# EasyEDA Pro project foc电动螺丝刀.eprj, board PCB1_1
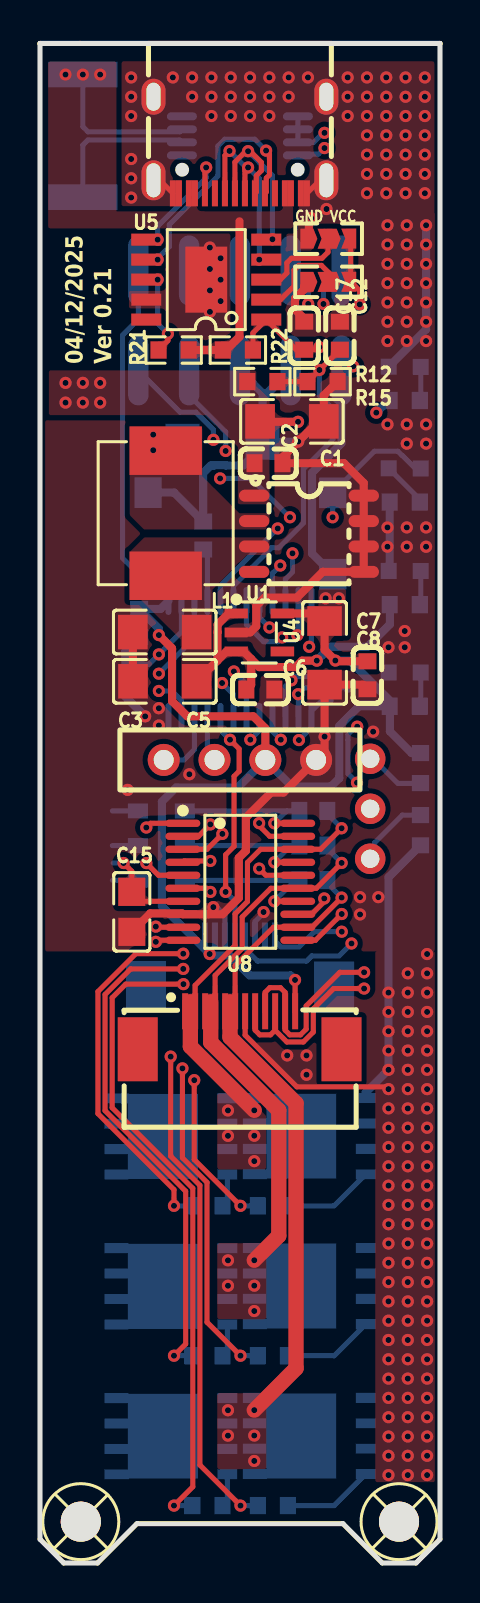
[diagram p3: board, top side]
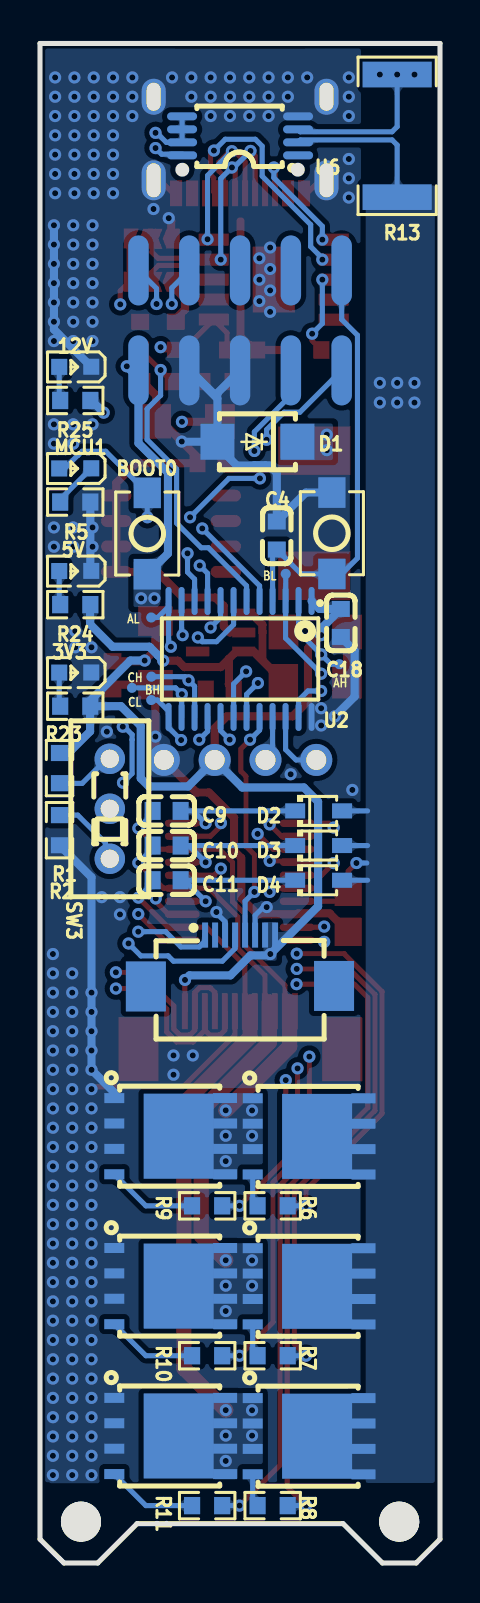
[diagram p4: board, bottom side, seen from below]

Outline 20 x 76 mm; copper layers: Top Layer, Inner1, Inner2, Bottom Layer. Coordinates in mm from the lower left corner of the outline.
Outline path: 0,76 20,76 20,1.19 18.8,0 17.11,0 15.15,1.97 4.84,1.97 2.88,0 1.19,0 0,1.19 0,76
Stack: Top Layer 0.035mm 外层铜厚1oz / Dielectric1 0.2104mm 7628 RC49% 8.6mil / Inner1 0.0152mm 内层铜厚 / Dielectric2 1.065mm 1.1mm H/HOZ Copper / Inner2 0.0152mm 内层铜厚 / Dielectric3 0.2104mm 7628 RC49% 8.6mil / Bottom Layer 0.035mm 外层铜厚1oz

## Design rules (mm)
template: 自定义配置1
spacing copperThickness1oz (default): track to track 0.102, other pairs 0.152 to 0.3
spacing copperThickness2oz: track to track 0.203, other pairs 0.152 to 0.3
track width copperThickness1oz (default): min 0.127, default 0.254, max 2.54
track width copperThickness2oz: min 0.203, default 0.406, max 2.54
track width trackWidth1: min 0.254, default 0.762, max 2.54
differential pair differentialPair (default): width min 0.127, default 0.254, max 2.54; gap min 0.152, default 0.152
via viaSize (default): diameter min 0.5, default 0.61, max 10; hole min 0.3, default 0.305, max 6.299
net L_VS2 uses copperRegionAll, trackWidth1
net L_VS3 uses copperRegionAll, trackWidth1
net +5V uses copperRegionAll, copperThickness2oz
net GND uses copperRegionAll, copperThickness2oz
net +12V uses copperRegionAll, copperThickness2oz
net L_VS1 uses copperRegionAll, trackWidth1
net +3V3 uses copperRegionAll
net +12V_BEFORE uses copperRegionAll, copperThickness2oz
net $1N4187 uses copperRegionAll

## Placement (name value [footprint] x y rotation side)
3V3  -  [LED_0603]  18.29 44.53 0 bottom
5V  -  [LED_0603]  18.29 49.61 0 bottom
12V  -  [LED_0603]  18.29 59.82 0 bottom
BOOT0  轻触按键3*4*H  [SW-SMD_L4.0-W2.9-LS5.0]  14.64 51.49 270 bottom
C1  10uF  [C1206]  12.6 57.1 0 top
C2  1uF  [C0603]  11.42 55.01 0 top
C3  22uF  [C1206]  6.24 46.56 0 top
C4  100nf  [C0603]  8.16 51.39 90 bottom
C5  10uf  [C1206]  6.24 44.1 180 top
C6  100nf  [C0603]  11.02 43.69 180 top
C7  10uf  [C1206]  14.23 45.52 270 top
C8  100nf  [C0603]  16.37 44.4 90 top
C9  100nF  [C0603]  13.67 37.62 0 bottom
C10  100nF  [C0603]  13.67 35.88 0 bottom
C11  100nF  [C0603]  13.67 34.15 0 bottom
C12  100nF  [C0603]  14.99 61.38 270 top
C15  22uF  [C0805]  4.59 32.57 90 top
C17  1uF  [C0603]  13.21 61.38 270 top
C18  100nF  [C0603]  4.96 47.02 270 bottom
D1  SS34F  [SMAF_L3.5-W2.6-LS4.7-FD]  9.13 56.08 180 bottom
D2  1N5819WS  [SOD-323_L1.8-W1.3-LS2.5-RD]  6.07 37.62 180 bottom
D3  1N5819WS  [SOD-323_L1.8-W1.3-LS2.5-RD]  6.07 35.88 180 bottom
D4  1N5819WS  [SOD-323_L1.8-W1.3-LS2.5-RD]  6.07 34.15 180 bottom
FPC1  FPC-05F-8PH20  [FPC-SMD_8P-P0.50_FPC-05F-8PH20]  10 30.12 180 bottom
FPC2  KH-CL0.5-H2.0-12PIN-SMT  [FPC-SMD_12P-P0.50_KH-CL0.5-H2.0-12PIN-SMT]  10.01 26.65 0 top
L1  47uH  [IND-SMD_L7.0-W6.6_FXL0630]  6.28 52.51 270 top
MCU1  -  [LED_0603]  18.29 54.74 0 bottom
OLED1  HS91L02W2C01  [OLED-TH_L38.0-W12.0_HS91L02W2C01]  10 40.17 90 top
P1  -  [PAD_S_2.54_2*5]  10 62.15 180 bottom
Q1  TPH1R403NL  [DSOP-8_L5.0-W5.0-P1.27-LS6.0-BL-EP]  6.6 21.34 270 bottom
Q2  TPH1R403NL  [DSOP-8_L5.0-W5.0-P1.27-LS6.0-BL-EP]  6.6 13.84 270 bottom
Q3  TPH1R403NL  [DSOP-8_L5.0-W5.0-P1.27-LS6.0-BL-EP]  6.6 6.34 270 bottom
Q4  TPH1R403NL  [DSOP-8_L5.0-W5.0-P1.27-LS6.0-BL-EP]  13.51 21.35 270 bottom
Q5  TPH1R403NL  [DSOP-8_L5.0-W5.0-P1.27-LS6.0-BL-EP]  13.51 13.85 270 bottom
Q6  TPH1R403NL  [DSOP-8_L5.0-W5.0-P1.27-LS6.0-BL-EP]  13.51 6.35 270 bottom
R1  10K  [R0603]  19.02 39.76 270 bottom
R2  10K  [R0603]  19.02 36.65 90 bottom
R5  10K  [R0603]  18.24 53.06 0 bottom
R6  10Ω  [R0603]  8.37 17.87 180 bottom
R7  10Ω  [R0603]  8.37 10.37 180 bottom
R8  10Ω  [R0603]  8.37 2.87 180 bottom
R9  10Ω  [R0603]  11.64 17.86 180 bottom
R10  10Ω  [R0603]  11.64 10.37 180 bottom
R11  10Ω  [R0603]  11.64 2.87 180 bottom
R12  10K  [R0603]  11.12 59.09 0 top
R13  10MΩ  [R2512]  2.14 71.38 270 bottom
R15  1K  [R0603]  14.13 59.09 180 top
R21  10K  [R0603]  6.68 60.67 180 top
R22  1K  [R0603]  9.89 60.67 180 top
R23  10K  [R0603]  18.24 42.85 0 bottom
R24  22K  [R0603]  18.24 47.93 0 bottom
R25  47K  [R0603]  18.24 58.14 0 bottom
SCREW1  -  [M2螺丝]  2.04 2.07 0 top
SCREW2  -  [M2螺丝]  17.95 2.07 0 top
SW2  nRST  [SW-SMD_L4.0-W2.9-LS5.0]  5.41 51.5 270 bottom
SW3  SS12D00G3  [SW-TH_SS-12D01-GX]  16.51 37.72 90 bottom
TP1  -  [Test-Point-0.5mm]  14.44 43.16 180 bottom
TP2  -  [Test-Point-0.5mm]  15.4 43.77 180 bottom
TP3  -  [Test-Point-0.5mm]  14.43 44.33 180 bottom
TP4  -  [Test-Point-0.5mm]  14.44 47.29 180 bottom
TP5  -  [Test-Point-0.5mm]  7.71 49.47 180 bottom
TP6  -  [Test-Point-0.5mm]  5.03 44.95 180 bottom
U1  XL1509-5.0  [SOIC-8_L4.9-W3.9-P1.27-LS6.0-TR]  13.45 51.48 90 top
U2  -  [TSSOP-24_L7.8-W4.4-P0.65-LS6.4-BL]  10 45.22 0 bottom
U4  TPRT9013-33GB  [SOT-23-5_L3.0-W1.7-P0.95-LS2.8-BL]  10.97 46.54 270 top
U5  CH224K  [ESSOP-10_L4.9-W3.9-P1.0-LS6.0-TL-EP]  8.31 64.19 90 top
U6  INA240A1PW  [TSSOP-8_L4.4-W3.0-P0.65-LS6.4-TL]  10 71.38 0 bottom
U8  FD6288T  [TSSOP-20_L6.5-W4.4-P0.65-LS6.4-BL]  10.01 34.07 270 top
U9  CFG3  [双置短接焊盘]  14.43 66.24 180 top
U10  CFG2  [双置短接焊盘]  14.43 64.08 180 top
USB1  typec  [USB-C-SMD_KH-TYPE-C-16P]  10 70.92 180 top

## Footprints (pads in the part's own frame, mm; a bottom-side part is the same pattern mirrored in y, then rotated)
C0603
  rect 0.8x0.9 smd: 1(-0.7,0) 2(0.7,0)
C0805
  rect 1.41x1.35 smd: 1(-1,0) 2(1,0)
C1206
  rect 1.485x1.728 smd: 1(-1.593,0) 2(1.593,0)
DSOP-8_L5.0-W5.0-P1.27-LS6.0-BL-EP
  rect 0.5x1 smd: 1(-1.905,-2.77) 2(-0.635,-2.77) 3(0.634,-2.77) 4(1.905,-2.77)
  rect 0.5x1.2 smd: 5(1.905,2.77) 6(0.635,2.77) 7(-0.634,2.77) 8(-1.905,2.77)
  custom 4.25x3.5 smd: 9(0,0.45)
ESSOP-10_L4.9-W3.9-P1.0-LS6.0-TL-EP
  rect 0.6x1.5 smd: 1(-2,-3) 2(-1,-3) 3(0,-3) 4(1,-3) 5(2,-3) 6(2,3) 7(1,3) 8(0,3) 9(-1,3) 10(-2,3)
  rect 3.3x2.1 smd: 11(0,0)
FPC-SMD_8P-P0.50_FPC-05F-8PH20
  rect 0.3x1.25 smd: 1(-1.75,1.288) 2(-1.25,1.288) 3(-0.75,1.288) 4(-0.25,1.288) 5(0.25,1.288) 6(0.75,1.288) 7(1.25,1.288) 8(1.75,1.288)
  rect 2x2.5 smd: 9(4.699,-1.258) 10(-4.712,-1.282)
FPC-SMD_12P-P0.50_KH-CL0.5-H2.0-12PIN-SMT
  rect 0.3x1.8 smd: 1(-2.75,0.95) 2(-2.25,0.95) 3(-1.75,0.95) 4(-1.25,0.95) 5(-0.75,0.95) 6(-0.25,0.95) 7(0.25,0.95) 8(0.75,0.95) 9(1.25,0.95) 10(1.75,0.95) 11(2.25,0.95) 12(2.75,0.95)
  rect 2x3.2 smd: 13(5.07,-0.95) 14(-5.119,-0.95)
IND-SMD_L7.0-W6.6_FXL0630
  rect 2.424x3.62 smd: 1(3.128,0) 2(-3.128,0)
LED_0603
  rect 0.8x0.8 smd: 1(-0.851,-0.01) 2(0.75,-0.005)
M2螺丝
  round 2 hole 2: 1(0,0)
OLED-TH_L38.0-W12.0_HS91L02W2C01
  round 1.6 hole 1: 1(0,-3.81) 2(0,-1.27) 3(0,1.27) 4(0,3.81)
PAD_S_2.54_2*5
  oval 1.02x3.5 smd: 1(-5.08,2.5) 2(-2.54,2.5) 3(0,2.5) 4(2.54,2.5) 5(5.08,2.5) 6(-5.08,-2.5) 7(-2.54,-2.5) 8(0,-2.5) 9(2.54,-2.5) 10(5.08,-2.5)
R0603
  rect 0.806x0.864 smd: 1(-0.753,0) 2(0.753,0)
R2512
  rect 1.282x3.456 smd: 1(-3.067,0) 2(3.067,0)
SMAF_L3.5-W2.6-LS4.7-FD
  rect 1.7x1.8 smd: 1(-2,0) 2(2,0)
SOD-323_L1.8-W1.3-LS2.5-RD
  rect 1x0.75 smd: 1(-1.173,0) 2(1.173,0)
SOIC-8_L4.9-W3.9-P1.27-LS6.0-TR
  oval 0.6x1.52 smd: 1(1.905,2.74) 2(0.635,2.74) 3(-0.635,2.74) 4(-1.905,2.74) 5(-1.905,-2.74) 6(-0.635,-2.74) 7(0.635,-2.74) 8(1.905,-2.74)
SOT-23-5_L3.0-W1.7-P0.95-LS2.8-BL
  rect 0.49x1.157 smd: 1(-0.95,-1.153) 2(0,-1.153) 3(0.95,-1.153)
  rect 0.49x1.175 smd: 4(0.95,1.153) 5(-0.95,1.153)
SW-SMD_L4.0-W2.9-LS5.0
  rect 1.53x1.36 smd: 1(-2.035,0) 2(2.035,0)
SW-TH_SS-12D01-GX
  round 1.524 hole 0.914: 1(-2.5,0) 2(0,0) 3(2.5,0)
Test-Point-0.5mm
  round 0.5 smd: 1(0,0)
TSSOP-8_L4.4-W3.0-P0.65-LS6.4-TL
  oval 1.5x0.4 smd: 1(-2.9,0.976) 2(-2.9,0.325) 3(-2.9,-0.325) 4(-2.9,-0.976) 5(2.9,-0.976) 6(2.9,-0.325) 7(2.9,0.325) 8(2.9,0.976)
TSSOP-20_L6.5-W4.4-P0.65-LS6.4-BL
  oval 0.364x1.742 smd: 1(-2.925,-2.871) 2(-2.275,-2.871) 3(-1.625,-2.871) 4(-0.975,-2.871) 5(-0.325,-2.871) 6(0.325,-2.871) 7(0.975,-2.871) 8(1.625,-2.871) 9(2.275,-2.871) 10(2.925,-2.871) 11(2.925,2.871) 12(2.275,2.871) 13(1.625,2.871) 14(0.975,2.871) 15(0.325,2.871) 16(-0.325,2.871) 17(-0.975,2.871) 18(-1.625,2.871) 19(-2.275,2.871) 20(-2.925,2.871)
TSSOP-24_L7.8-W4.4-P0.65-LS6.4-BL
  oval 0.3x1.4 smd: 1(-3.575,-2.9) 2(-2.925,-2.9) 3(-2.275,-2.9) 4(-1.625,-2.9) 5(-0.975,-2.9) 6(-0.325,-2.9) 7(0.325,-2.9) 8(0.975,-2.9) 9(1.625,-2.9) 10(2.275,-2.9) 11(2.925,-2.9) 12(3.575,-2.9) 13(3.575,2.9) 14(2.925,2.9) 15(2.275,2.9) 16(1.625,2.9) 17(0.975,2.9) 18(0.325,2.9) 19(-0.325,2.9) 20(-0.975,2.9) 21(-1.625,2.9) 22(-2.275,2.9) 23(-2.925,2.9) 24(-3.575,2.9)
USB-C-SMD_KH-TYPE-C-16P
  oval 1.2x2 hole 0.7x1.7: 1(-4.32,1.765) 2(4.32,1.765)
  oval 1.2x1.8 hole 0.7x1.4: 3(-4.32,-2.415) 4(4.32,-2.415)
  rect 0.3x1.3 smd: A1(-3.35,2.415) A4(-2.55,2.415) A5(-1.25,2.415) A6(-0.25,2.415) A7(0.25,2.415) A8(1.25,2.415) A9(2.55,2.415) A12(3.35,2.415) B1(3.05,2.415) B4(2.25,2.415) B5(1.75,2.415) B6(0.75,2.415) B7(-0.75,2.415) B8(-1.75,2.415) B9(-2.25,2.415) B12(-3.05,2.415)
双置短接焊盘
  custom 0.748x1.005 smd: 1(-1.105,-0.004)
  custom 1.154x1.006 smd: 2(-0.025,0)
  custom 0.853x1.001 smd: 3(0.991,0)

## Nets
+3V3: BOOT0.2 C7.1 C8.2 C18.1 FPC1.7 FPC1.8 FPC2.12 OLED1.2 P1.6 R1.1 R23.1 U2.1 U4.5 U6.5 U6.6 U6.7
+5V: C3.2 C5.1 C6.2 L1.1 R24.1 U1.3 U4.1 U4.3
+12V: C1.1 C2.1 C15.2 D2.2 D3.2 D4.2 Q1.5 Q1.6 Q1.7 Q1.8 Q1.9 Q2.5 Q2.6 Q2.7 Q2.8 Q2.9 Q3.5 Q3.6 Q3.7 Q3.8 Q3.9 R12.1 R13.2 R25.1 U1.1 U6.2 U8.7
+12V_BEFORE: R13.1 R21.1 R22.2 U6.3 USB1.A4 USB1.A9 USB1.B4 USB1.B9
GND: 3V3.1 5V.1 12V.1 C1.2 C2.2 C3.1 C4.2 C5.2 C6.1 C7.2 C8.1 C12.1 C15.1 C17.1 C18.2 D1.1 FPC1.3 FPC1.6 FPC2.7 OLED1.1 P1.7 P1.8 Q4.1 Q4.2 Q4.3 Q5.1 Q5.2 Q5.3 Q6.1 Q6.2 Q6.3 R2.1 R5.1 R15.1 SW2.1 U1.5 U1.6 U1.7 U1.8 U2.24 U4.2 U5.9 U5.11 U6.4 U8.8 U9.3 U10.3 USB1.1 USB1.2 USB1.3 USB1.4 USB1.A1 USB1.A12 USB1.B1 USB1.B12
VDD: C17.2 R22.1 U5.1 U9.1 U10.1
CC1: U5.7 USB1.A5
CC2: U5.6 USB1.B5
CFG2: U5.2 U10.2
CFG3: U5.3 U9.2
DM: U5.5 USB1.A7 USB1.B7
DP: U5.4 USB1.A6 USB1.B6
E_A: FPC1.1 U2.7
E_B: FPC1.4 U2.8
E_PUSH: FPC1.5 U2.20
H_ADC_A: FPC2.9 FPC2.11 U2.9
H_ADC_B: FPC2.8 FPC2.10 U2.10
I2C_SCL: OLED1.3 U2.21
I2C_SDA: OLED1.4 U2.22
L_AH: R6.2 U8.19
L_AL: R9.2 U8.11
L_BH: R7.2 U8.16
L_BL: R10.2 U8.10
L_CH: R8.2 U8.13
L_CL: R11.2 U8.9
L_VB1: C9.1 D2.1 U8.20
L_VB2: C10.1 D3.1 U8.17
L_VB3: C11.1 D4.1 U8.14
L_VS1: C9.2 FPC2.1 FPC2.2 Q1.1 Q1.2 Q1.3 Q4.5 Q4.6 Q4.7 Q4.8 Q4.9 U8.18
L_VS2: C10.2 FPC2.3 FPC2.4 Q2.1 Q2.2 Q2.3 Q5.5 Q5.6 Q5.7 Q5.8 Q5.9 U8.15
L_VS3: C11.2 FPC2.5 FPC2.6 Q3.1 Q3.2 Q3.3 Q6.5 Q6.6 Q6.7 Q6.8 Q6.9 U8.12
LED/BOOT0: BOOT0.1 MCU1.2 U2.23
M_ADC: U2.5 U6.8
M_AH: TP6.1 U2.2 U8.1
M_AL: TP4.1 U2.12 U8.4
M_BH: TP2.1 U2.14 U8.2
M_BL: TP5.1 U2.3 U8.5
M_BRK: SW3.2 U2.11
M_CH: TP3.1 U2.15 U8.3
M_CL: TP1.1 U2.13 U8.6
NRST: C4.1 P1.5 SW2.2 U2.4
PWR: C12.2 R12.2 R15.2 U2.6
RX: P1.10 U2.19
SW_CLK: P1.2 U2.17
SW_DIO: P1.1 U2.16
TX: P1.9 U2.18
$1N3741: Q4.4 R9.1
$1N3748: Q5.4 R10.1
$1N3762: Q1.4 R6.1
$1N3769: Q2.4 R7.1
$1N3776: Q3.4 R8.1
$1N3872: Q6.4 R11.1
$1N4187: D1.2 L1.2 U1.2
$1N5948: R21.2 U5.8
$1N6225: R1.2 SW3.3
$1N6251: R2.2 SW3.1
$1N10226: 3V3.2 R23.2
$1N10294: 5V.2 R24.2
$1N10362: 12V.2 R25.2
$1N25782: MCU1.1 R5.2

Pads without a net: FPC1 2 9 10; FPC2 13 14; P1 3 4; SCREW1 1; SCREW2 1; U1 4; U4 4; U5 10; U6 1; USB1 A8 B8

## Via types
v1: diameter 0.61, hole 0.305, Top Layer to Bottom Layer, 311 vias

## Routing (per net, layer and track width the routed paths; a pad name or vN(x,y) marks a point on that pad's centre or on a via; arc(x,y) is an arc through that point)
+3V3: length 86.1
  Top Layer w0.254: v1(12.75,29.16) 12.76,29.16 12.76,27.6
  Top Layer w0.406: C8.2 14.8,45.1 v1(14.77,45.14) 14.23,45.67 C7.1 13.85,47.49 12.12,47.49 ; OLED1.2 11.27,41.75 10.67,42.35 7.37,42.35 6.6,43.11 6.6,45.72 6.58,45.74 6.58,45.77 v1(5.94,46.41)
  Inner2 w0.406: v1(15.66,59.85) 16.71,60.91 16.71,67.08 15.49,68.3 15.49,70.9 14.86,71.53 v1(14.22,71.53)
  Bottom Layer w0.254: v1(14.22,71.53) 14.16,71.53 13.68,71.05 U6.7 U6.6 U6.5
  Bottom Layer w0.406: 17.5,42.85 17.5,41.59 18.57,40.51 R1.1 ; 17.5,42.85 17.5,43.12 15.48,45.14 v1(14.77,45.14) ; 17.5,42.85 15.95,42.85 14.96,41.86 14.96,39.25 14.56,38.84 12.59,38.84 OLED1.2 9.89,38.79 6.81,38.79 6.1,38.08 6.1,32.85 v1(8.48,30.46) 8.55,30.39 9.48,30.39 10.48,29.39 12.52,29.39 v1(12.75,29.16) ; 6.42,48.12 6.02,47.72 C18.1 5.94,46.73 v1(5.94,46.41) ; BOOT0.2 13.6,50.49 13.6,54.53 15.08,56.01 P1.6 15.46,59.65 v1(15.66,59.85)
  vias: v1(14.28,48.25) v1(14.94,48.25)
+5V: length 17.1
  Top Layer w0.406: U4.1 9.44,47.49 8.88,46.93 8.88,46.56 8.87,46.55 8.87,45.14 ; v1(13.84,45.13) 13.11,45.13 12.78,44.81 10.96,44.81 10.56,45.22 ; 10.56,45.22 10.56,43.93 C6.2 ; 10.56,45.22 10.18,45.59 U4.3 9.33,45.59 8.87,45.14 ; 8.87,45.14 C5.1
  Bottom Layer w0.406: v1(13.84,45.13) 14.11,45.4 14.11,45.41 14.49,45.8 14.5,45.8 14.53,45.83 16.37,45.83 17.5,46.95 17.5,47.94
+12V: length 23.4
  Top Layer w0.254: v1(4.18,35.01) 4.59,34.6 C15.2 5.06,33.1 U8.7
  Top Layer w0.406: C1.1 11.03,57.08 v1(12.9,57.08)
  Inner2 w0.406: v1(16.81,57.53) 13.36,57.53 v1(12.9,57.08)
  Bottom Layer w0.254: D3.2 3.62,35.88 ; U6.2 6.97,71.18 2.4,71.18 2.14,70.92 2.14,68.26 ; D2.2 3.62,37.62 ; D4.2 3.62,34.15 ; v1(4.18,35.01) 3.66,35.01
  Bottom Layer w0.406: v1(16.81,57.53) 17.42,58.14 R25.1
  vias: v1(1.28,59.02) v1(1.28,58.04) v1(2.14,59.02) v1(2.14,58.04) v1(3.01,59.02) v1(3.01,58.04)
+12V_BEFORE: length 16.3
  Top Layer w0.406: R21.1 R22.2 9.31,60.67 9.97,61.33 9.97,67.1
  Bottom Layer w0.254: v1(2.14,74.45) 2.14,71.84 2.4,71.58 6.99,71.58 7.1,71.69 U6.3
  vias: v1(1.28,74.45) v1(3.01,74.45)
GND: length 114
  Top Layer w0.254: USB1.2 6,69.16 6.65,68.51 ; USB1.1 14,69.16 13.35,68.51 ; 10.26,27.6 10.26,26.4 12.84,23.82 17.31,23.82 v1(17.42,23.7)
  Top Layer w0.406: v1(8.67,32.8) 8.67,32.69 8.42,32.45 ; C3.1 4.64,44.1 C5.2 ; C15.1 5.51,32.49 7.1,32.49 U8.8 8.42,32.45 ; C8.1 16.14,43.93 C7.2 v1(14.23,41.33) 14.23,40.59 OLED1.1 12.18,38.54 11.55,38.54 10.3,37.28 10.3,35.62 9.94,35.27 9.94,33.26 9.13,32.45 8.42,32.45 ; C17.1 13.21,62.24 12.75,62.7 12.75,63.24 13.21,63.7 13.21,63.85 U10.3 ; U9.3 13.44,67.14 v1(13.56,67.26) ; U4.2 10.51,46.54 10.81,46.85 10.81,47.87 11.23,48.29 12.85,48.29 14.14,49.57 U1.5 U1.7 16.19,54.02 15.2,55.01 C2.2 12.12,55.3 v1(12.91,56.09) 13.92,57.1 C1.2 14.19,58.4 R15.1
  Bottom Layer w0.254: 11.13,58.41 12.37,59.65 P1.7 ; FPC1.6 9.25,32.39 8.89,32.74 8.73,32.74 v1(8.67,32.8) ; FPC1.3 10.75,32.08 11.18,32.51 v1(11.18,32.56)
  Bottom Layer w0.406: C18.2 4.27,45.63 4.27,43.34 v1(5.26,42.35) ; R2.1 17.42,34.3 v1(17.42,28.53) v1(17.42,27.56) v1(17.42,26.6) v1(17.42,25.63) v1(17.42,24.67) 16.28,23.53 Q4.1 ; P1.7 11.13,58.24 D1.1 ; D1.1 11.13,55.86 10.16,54.89 9.29,54.89 9.28,54.91 8.73,54.91 8.72,54.89 8.53,54.89 8.16,54.52 C4.2 6.71,53.54 5.46,53.54 ; D1.1 12.9,56.08 v1(12.91,56.09) ; R5.1 17.48,49.67 5V.1 ; 12V.1 19.3,61.7 v1(19.3,62.08) v1(19.3,63.05) v1(19.3,64.01) v1(19.3,64.98) v1(19.3,65.94) v1(19.3,66.91) ; P1.8 11.13,58.51 11.13,58.41
  vias: v1(4.38,38.67) v1(4.56,74.3) v1(4.56,73.34) v1(4.56,72.37) v1(4.56,70.22) v1(4.56,69.26) v1(4.56,68.29) v1(5.94,42.75) v1(5.94,41.89) v1(6.64,74.3) v1(7.47,39.45) v1(7.61,74.3) v1(7.61,73.34) v1(8.49,65.79) v1(8.49,64.72) v1(8.5,63.65) v1(8.5,62.58) v1(8.57,74.3) v1(8.57,73.34) v1(8.57,72.37) v1(9.03,65.26) v1(9.03,64.18) v1(9.03,63.11) v1(9.54,74.3) v1(9.54,73.34) v1(9.54,72.37) v1(10.5,74.3) v1(10.5,73.34) v1(10.5,72.37) v1(11.47,74.3) v1(11.47,73.34) v1(11.47,72.37) v1(12.43,74.3) v1(12.43,73.34) v1(12.36,25.39) v1(13.33,25.39) v1(13.33,24.42) v1(13.4,74.3) v1(14.33,67.72) v1(15.38,74.3) v1(15.38,73.34) v1(15.38,72.37) v1(16,33.3) v1(16,32.44) v1(16.35,74.3) v1(16.35,73.34) v1(16.35,72.37) v1(16.35,71.4) v1(16.35,70.44) v1(16.35,69.47) v1(16.35,68.51) v1(16.66,41.58) v1(16.92,33.3) v1(17.31,74.3) v1(17.31,73.34) v1(17.31,72.37) v1(17.31,71.4) v1(17.31,70.44) v1(17.31,69.47) v1(17.31,68.51) v1(17.37,66.91) v1(17.37,65.94) v1(17.37,64.98) v1(17.37,64.01) v1(17.37,63.05) v1(17.37,62.08) v1(17.37,61.12) v1(17.37,56.95) v1(17.37,51.79) v1(17.37,50.83) v1(17.42,45.8) v1(17.42,22.74) v1(17.42,21.77) v1(17.42,20.81) v1(17.42,19.84) v1(17.42,18.88) v1(17.42,17.91) v1(17.42,16.95) v1(17.42,15.98) v1(17.42,15.02) v1(17.42,14.05) v1(17.42,13.08) v1(17.42,12.12) v1(17.42,11.15) v1(17.42,10.19) v1(17.42,9.22) v1(17.42,8.26) v1(17.42,7.29) v1(17.42,6.33) v1(17.42,5.36) v1(17.42,4.4) v1(18.24,46.61) v1(18.24,45.8) v1(18.28,74.3) v1(18.28,73.34) v1(18.28,72.37) v1(18.28,71.4) v1(18.28,70.44) v1(18.28,69.47) v1(18.28,68.51) v1(18.34,66.91) v1(18.34,65.94) v1(18.34,64.98) v1(18.34,64.01) v1(18.34,63.05) v1(18.34,62.08) v1(18.34,61.12) v1(18.34,56.95) v1(18.34,55.99) v1(18.34,51.79) v1(18.34,50.83) v1(18.39,29.49) v1(18.39,28.53) v1(18.39,27.56) v1(18.39,26.6) v1(18.39,25.63) v1(18.39,24.67) v1(18.39,23.7) v1(18.39,22.74) v1(18.39,21.77) v1(18.39,20.81) v1(18.39,19.84) v1(18.39,18.88) v1(18.39,17.91) v1(18.39,16.95) v1(18.39,15.98) v1(18.39,15.02) v1(18.39,14.05) v1(18.39,13.08) v1(18.39,12.12) v1(18.39,11.15) v1(18.39,10.19) v1(18.39,9.22) v1(18.39,8.26) v1(18.39,7.29) v1(18.39,6.33) v1(18.39,5.36) v1(18.39,4.4) v1(19.24,74.3) v1(19.24,73.34) v1(19.24,72.37) v1(19.24,71.4) v1(19.24,70.44) v1(19.24,69.47) v1(19.24,68.51) v1(19.3,61.12) v1(19.3,56.95) v1(19.3,55.99) v1(19.3,51.79) v1(19.3,50.83) v1(19.35,30.46) v1(19.35,29.49) v1(19.35,28.53) v1(19.35,27.56) v1(19.35,26.6) v1(19.35,25.63) v1(19.35,24.67) v1(19.35,23.7) v1(19.35,22.74) v1(19.35,21.77) v1(19.35,20.81) v1(19.35,19.84) v1(19.35,18.88) v1(19.35,17.91) v1(19.35,16.95) v1(19.35,15.98) v1(19.35,15.02) v1(19.35,14.05) v1(19.35,13.08) v1(19.35,12.12) v1(19.35,11.15) v1(19.35,10.19) v1(19.35,9.22) v1(19.35,8.26) v1(19.35,7.29) v1(19.35,6.33) v1(19.35,5.36) v1(19.35,4.4)
VDD: length 12.2
  Top Layer w0.254: U9.1 U10.1 15.99,63.63 v1(15.99,62.95) ; R22.1 10.65,61.52 U5.1 12.82,60.68 C17.2 13.84,60.68 v1(13.97,60.81)
  Inner2 w0.254: v1(15.99,62.95) 15.99,61.81 14.99,60.81 v1(13.97,60.81)
CC1: length 12
  Top Layer w0.254: v1(11.3,70.64) 11.47,70.47 11.47,69.43 11.32,69.27 11.32,68.58 11.25,68.51 ; 5.88,65.26 v1(5.88,65.19)
  Bottom Layer w0.254: 5.88,65.26 6.47,65.84 6.47,66.94 8.89,69.36 8.89,70.87 9.23,71.21 10.74,71.21 v1(11.3,70.64)
CC2: length 6.5
  Top Layer w0.254: 8.25,68.51 8.25,69.74 v1(8.31,69.8) ; v1(5.88,66.19) U5.6
  Bottom Layer w0.254: v1(8.31,69.8) 8.31,69.28 5.88,66.86 v1(5.88,66.19)
CFG2: length 4.9
  Top Layer w0.254: U5.2 12.03,63.19 12.7,63.86 12.7,64.66 12.94,64.9 14.07,64.9 14.46,64.52 U10.2
CFG3: length 4.7
  Top Layer w0.254: U5.3 12.01,64.19 12.34,64.52 12.34,65.03 12.57,65.26 14.1,65.26 14.4,65.56 14.4,65.93 14.46,65.98 U9.2
DM: length 9.9
  Top Layer w0.254: 9.75,68.51 9.75,70.07 10.29,70.61 v1(10.4,70.61) 10.51,70.61 11.07,70.05 11.07,69.64 10.82,69.39 10.82,68.58 10.75,68.51
  Bottom Layer w0.254: v1(11.62,66.21) 11.62,69.39 10.99,70.03 10.99,70.04 10.65,70.38 10.63,70.38 v1(10.4,70.61)
DP: length 9.7
  Top Layer w0.254: 9.25,68.51 9.25,70.39 v1(9.48,70.62) ; 10.25,68.51 10.25,69.64 v1(10.4,69.8)
  Bottom Layer w0.254: v1(10.96,65.19) 10.96,69.24 v1(10.4,69.8) 10.3,69.8 v1(9.48,70.62)
E_A: length 29.4
  Inner2 w0.254: v1(12.11,46.29) 12.11,46.5 12.79,47.18 14.14,47.18 18.47,42.85 18.47,33.94 16.1,31.58 v1(15.09,31.58)
  Bottom Layer w0.254: U2.7 10.32,46.93 11.18,46.08 11.89,46.08 v1(12.11,46.29) ; FPC1.1 11.75,31.11 12.04,30.81 12.95,30.81 13.72,31.58 v1(15.09,31.58)
E_B: length 31.6
  Inner2 w0.254: v1(15.58,30.99) 16.4,30.99 18.82,33.4 18.82,43 14.22,47.6 12.29,47.6 v1(11.47,46.79)
  Bottom Layer w0.254: v1(15.58,30.99) 14.96,30.37 13.59,30.37 13.33,30.1 10.88,30.1 10.25,30.74 FPC1.4 ; U2.8 10.97,47.29 v1(11.47,46.79)
E_PUSH: length 11.8
  Top Layer w0.254: v1(9.5,41.18) 9.96,40.72 9.96,39.6 9.7,39.35 9.7,35.84 9.28,35.42 v1(9.28,33.56)
  Bottom Layer w0.254: FPC1.5 9.75,33.1 v1(9.28,33.56) ; 9.02,42.32 9.02,41.66 v1(9.5,41.18)
H_ADC_A: length 39.3
  Top Layer w0.254: v1(16.21,29.54) 14.99,29.54 13.31,27.86 13.31,26.7 13.02,26.42 12.49,26.42 12.26,26.65 12.26,28.54 12.02,28.77 11.49,28.77 11.26,28.54 11.26,27.6
  Inner2 w0.254: v1(16.21,29.54) 16.56,29.54 19.18,32.16 19.18,47.1 16.39,49.89 v1(12.01,49.89)
  Bottom Layer w0.254: v1(12.01,49.89) 11.62,49.5 U2.9
H_ADC_B: length 40.5
  Top Layer w0.254: 11.76,26.65 11.76,26.65 12.34,26.06 13.17,26.06 13.66,26.56 13.66,27.72 14.68,28.73 v1(16.21,28.73) ; 11.76,26.65 11.52,26.42 10.99,26.42 10.76,26.65 10.76,27.6 ; 11.76,26.65 11.76,27.6
  Inner2 w0.254: v1(16.21,28.73) 16.56,28.73 19.53,31.7 19.53,47.25 16.28,50.5 v1(12.62,50.5)
  Bottom Layer w0.254: U2.10 12.27,49.21 12.62,49.56 v1(12.62,50.5)
I2C_SCL: length 2.3
  Bottom Layer w0.254: OLED1.3 8.37,40.52 U2.21
I2C_SDA: length 3.4
  Bottom Layer w0.254: OLED1.4 7.2,40.17 7.72,40.69 U2.22
L_AH: length 28.6
  Top Layer w0.254: U8.19 11.49,36.35 10.96,36.88 v1(10.96,37.01) ; v1(7.16,30.48) 4.79,30.48 2.9,28.58 2.9,22.48 6.7,18.67 v1(6.7,17.87)
  Inner2 w0.254: v1(7.16,30.48) 10.06,33.37 10.06,36.11 v1(10.96,37.01)
  Bottom Layer w0.254: R6.2 v1(6.7,17.87)
L_AL: length 23.8
  Top Layer w0.254: v1(15.09,32.46) 13.77,31.15 U8.11 ; v1(7.71,24.15) 7.71,20.18 v1(10.03,17.86)
  Inner2 w0.254: v1(7.71,24.15) 7.71,27.76 12.41,32.46 v1(15.09,32.46)
  Bottom Layer w0.254: R9.2 v1(10.03,17.86)
L_BH: length 34
  Top Layer w0.254: v1(10.96,34.73) 11.29,34.4 U8.16 ; v1(6.7,10.37) 7.28,10.95 7.28,18.59 3.25,22.62 3.25,28.43 4.53,29.71 v1(7.16,29.71)
  Inner2 w0.254: v1(10.96,34.73) 10.41,34.19 10.41,33.22 7.9,30.71 7.9,30.39 7.23,29.71 v1(7.16,29.71)
  Bottom Layer w0.254: R7.2 v1(6.7,10.37)
L_BL: length 25
  Top Layer w0.254: v1(7.12,24.74) 7.12,20.26 8.35,19.04 8.35,12.04 v1(10.03,10.37) ; v1(5.79,31.07) 5.87,31.15 U8.10
  Inner2 w0.254: v1(7.12,24.74) 7.12,25.67 5.49,27.31 5.49,30.76 v1(5.79,31.07)
  Bottom Layer w0.254: R10.2 v1(10.03,10.37)
L_CH: length 42.8
  Top Layer w0.254: U8.13 13.58,32.45 14.22,33.09 14.22,33.23 v1(14.21,33.24) ; v1(6.7,2.87) 7.64,3.81 7.64,18.74 3.61,22.77 3.61,28.28 4.28,28.95 v1(7.17,28.95)
  Inner2 w0.254: v1(7.17,28.95) 7.53,28.95 8.45,29.87 9.32,29.87 12.68,33.24 v1(14.21,33.24)
  Bottom Layer w0.254: R8.2 v1(6.7,2.87)
L_CL: length 33.5
  Top Layer w0.254: v1(10.03,2.87) 8,4.9 8,18.89 6.53,20.35 v1(6.53,25.33) ; v1(5.79,31.83) 5.82,31.8 U8.9
  Inner2 w0.254: v1(6.53,25.33) 5.13,26.73 5.13,31.23 5.55,31.65 5.61,31.65 v1(5.79,31.83)
  Bottom Layer w0.254: R11.2 v1(10.03,2.87)
L_VB1: length 7.8
  Top Layer w0.254: 12.89,37 v1(11.72,37)
  Bottom Layer w0.254: 12.34,37.62 C9.1 ; 12.34,37.62 v1(11.72,37) ; 12.34,37.62 D2.1
L_VB2: length 8.1
  Top Layer w0.254: v1(11.72,35.05) U8.17
  Bottom Layer w0.254: v1(11.72,35.05) 12.55,35.88 ; 12.55,35.88 C10.1 ; 12.55,35.88 D3.1
L_VB3: length 8.4
  Top Layer w0.254: v1(11.72,33.1) U8.14
  Bottom Layer w0.254: D4.1 12.77,34.15 ; 12.77,34.15 v1(11.72,33.1) ; 12.77,34.15 C11.1
L_VS1: length 21.4
  Top Layer w0.254: v1(15.08,36.75) 14.03,35.7 11.03,35.7 10.37,35.04 10.37,33.08 9.75,32.46 9.75,30.89 7.76,28.89 7.76,28.07
  Top Layer w0.762: v1(10.71,22.64) 7.52,25.83 7.52,28.07
  Bottom Layer w0.254: C9.2 14.37,37.46 v1(15.08,36.75)
  vias: v1(9.4,22.64) v1(9.4,21.37) v1(10.71,21.37) v1(10.71,20.1)
L_VS2: length 26.9
  Top Layer w0.254: v1(15.08,35.02) 13.81,33.75 U8.15 11.54,33.75 10.11,32.31 10.11,30.74 8.76,29.39 8.76,28.07
  Top Layer w0.762: v1(10.71,15.14) 11.94,16.37 11.94,22.64 8.53,26.04 8.53,28.07
  Bottom Layer w0.254: v1(15.08,35.02) 14.37,35.73 C10.2
  vias: v1(9.4,15.14) v1(9.4,13.87) v1(10.71,13.87) v1(10.71,12.6)
L_VS3: length 32.8
  Top Layer w0.254: 9.76,27.6 9.76,29.88 11.67,31.8 U8.12 13.6,31.8 v1(15.08,33.28)
  Top Layer w0.762: 9.5,28.07 9.5,26.3 12.8,22.99 12.8,9.73 v1(10.71,7.65)
  Bottom Layer w0.254: v1(15.08,33.28) 14.37,34 C11.2
  vias: v1(9.4,7.64) v1(9.4,6.37) v1(10.71,6.38) v1(10.71,5.11)
LED/BOOT0: length 28.4
  Inner2 w0.254: v1(14.63,52.3) v1(12.5,52.3) ; v1(5.94,43.62) 7.39,43.62 9.24,45.46 9.24,54.01 v1(9,54.25)
  Bottom Layer w0.254: MCU1.2 18.77,54.75 18.11,55.4 18.1,55.4 17.89,55.6 16.72,55.6 BOOT0.1 14.64,52.31 v1(14.63,52.3) ; v1(12.5,52.3) 10.55,54.25 v1(9,54.25) ; v1(5.94,43.62) 6.6,43.62 7.07,43.15 U2.23
M_ADC: length 30.2
  Inner2 w0.254: v1(11.89,51.74) 11.19,52.44 11.19,59.13 13.11,61.04 13.11,61.55 13.46,61.9 13.97,61.9 14.76,62.69 14.76,65.24 12.11,67.89 12.11,70.1 12.78,70.77 v1(14.22,70.77)
  Bottom Layer w0.254: 12.9,70.46 13.92,70.46 v1(14.22,70.77) ; v1(11.89,51.74) 9.02,48.88 9.02,48.12
M_AH: length 15.9
  Top Layer w0.254: 7.14,37 5.53,37 v1(5.32,36.78)
  Inner2 w0.254: v1(5.32,36.78) 5.32,38.96 4.32,39.96 4.32,43.7 5.94,45.32 v1(5.94,45.44)
  Bottom Layer w0.254: U2.2 7.07,46.57 v1(5.94,45.44) 5.45,44.95 TP6.1
M_AL: length 22.8
  Top Layer w0.254: v1(8.52,35.11) 7.21,35.11 U8.4
  Inner2 w0.254: v1(15.85,39.03) 15.2,39.03 13.84,37.67 10.79,37.67 9.7,36.58 9.7,35.84 9.02,35.16 8.57,35.16 v1(8.52,35.11) ; v1(15.86,41.83) 13,44.69 13,45.37 v1(13.46,45.83)
  Bottom Layer w0.254: 13.57,47.82 13.57,45.94 v1(13.46,45.83) ; 13.57,47.82 U2.12 ; 13.57,47.82 14.1,47.29 TP4.1 ; v1(15.85,39.03) 15.4,39.48 15.4,41.17 15.39,41.18 15.39,41.43 15.79,41.83 v1(15.86,41.83)
M_BH: length 17.3
  Top Layer w0.254: v1(8.52,36.94) 7.92,36.35 U8.2
  Inner2 w0.254: v1(12.91,43.45) 13.23,43.45 14.88,41.8 14.88,39.72 13.55,38.38 9.96,38.38 v1(8.52,36.94)
  Bottom Layer w0.254: 12.92,42.32 12.92,43.44 v1(12.91,43.45) 13.23,43.77 15.1,43.77
M_BL: length 19.1
  Top Layer w0.254: U8.5 5.93,34.4 v1(5.32,35.01)
  Inner2 w0.254: v1(5.94,44.48) 5.6,44.48 4.67,43.55 4.67,40.11 6.35,38.43 6.35,36.04 v1(5.32,35.01)
  Bottom Layer w0.254: v1(5.94,44.48) 7.72,46.26 U2.3 7.71,48.12 TP5.1
M_BRK: length 14.4
  Inner2 w0.254: 16.53,37.67 18.11,39.25 18.11,42.62 14.02,46.71 13.18,46.71 v1(12.87,46.41)
  Bottom Layer w0.254: 12.92,48.12 12.92,46.46 v1(12.87,46.41)
M_CH: length 19.6
  Top Layer w0.254: 7.14,35.7 8.35,35.7 v1(9.12,36.47)
  Inner2 w0.254: v1(9.12,36.47) 9.12,36.5 10.65,38.03 13.7,38.03 15.24,39.57 15.24,41.95 13.04,44.15 v1(12.57,44.15)
  Bottom Layer w0.254: U2.15 12.27,43.85 v1(12.57,44.15) 12.75,44.33 TP3.1
M_CL: length 15.8
  Top Layer w0.254: U8.6 8.34,33.75 v1(8.52,33.56)
  Inner2 w0.254: v1(12.95,41.16) 12.45,40.66 12.45,39.45 11.74,38.74 9.42,38.74 7.57,36.89 7.57,34.52 v1(8.52,33.56)
  Bottom Layer w0.254: TP1.1 14.13,43.16 13.57,42.61 U2.13 13.57,41.79 v1(12.95,41.16)
NRST: length 22.2
  Bottom Layer w0.254: SW2.2 4.92,49.47 4.13,50.26 4.13,61.41 4.92,62.2 P1.5 ; 5.46,49.47 6.94,49.47 C4.1 8.37,50.48 U2.4
PWR: length 17.9
  Top Layer w0.254: R12.2 R15.2 13.39,59.09 v1(13.97,59.67) 13.98,59.67 C12.2
  Bottom Layer w0.254: v1(13.97,59.67) 13.97,58.4 14.64,57.72 14.64,56.19 13.17,54.71 13.17,52.01 11.94,50.78 11.58,50.78 9.67,48.87 U2.6
RX: length 20.2
  Inner2 w0.254: v1(8.67,56.18) 8.67,55.41 9.59,54.48 9.59,45.32 9.11,44.83 9.11,44.02 v1(9.1,44.01)
  Bottom Layer w0.254: v1(9.1,44.01) 9.67,43.44 U2.19 ; v1(8.67,56.18) 8.67,56.68 7.79,57.56 7.01,57.56 P1.10
SW_CLK: length 26.5
  Inner2 w0.254: v1(10.52,41.18) 10.3,41.39 10.3,59.35 12.4,61.44 12.4,61.95 v1(13.41,62.97)
  Bottom Layer w0.254: v1(13.41,62.97) 13.41,63.77 P1.2 ; U2.17 10.97,41.63 v1(10.52,41.18)
SW_DIO: length 27.5
  Inner2 w0.254: v1(14.17,62.97) 14.17,62.61 13.82,62.26 13.2,62.26 12.75,61.81 12.75,61.19 10.66,59.1 10.66,42.56 v1(12.04,41.18)
  Bottom Layer w0.254: P1.1 14.17,63.75 v1(14.17,62.97) ; U2.16 11.62,41.6 v1(12.04,41.18)
TX: length 18.7
  Inner2 w0.254: v1(9.28,55.62) 9.95,54.95 9.95,45.17 9.69,44.91 v1(9.69,44.59)
  Bottom Layer w0.254: U2.18 10.32,43.96 v1(9.69,44.59) ; P1.9 7.46,58.4 9.28,56.57 v1(9.28,55.62)
$1N3741: length 4.5
  Bottom Layer w0.254: R9.1 14.71,17.86 Q4.4
$1N3748: length 4.5
  Bottom Layer w0.254: Q5.4 14.71,10.37 R10.1
$1N3762: length 1.7
  Bottom Layer w0.254: R6.1 9.37,18.11 Q1.4
$1N3769: length 1.7
  Bottom Layer w0.254: Q2.4 9.37,10.61 R7.1
$1N3776: length 1.7
  Bottom Layer w0.254: Q3.4 9.37,3.12 R8.1
$1N3872: length 4.5
  Bottom Layer w0.254: Q6.4 14.71,2.87 R11.1
$1N4187:
  vias: v1(5.66,56.44) v1(5.66,55.66)
$1N5948: length 4
  Top Layer w0.254: v1(6.39,61.48) 6.39,61.14 R21.2 ; 5.88,64.24 v1(5.88,64.19)
  Bottom Layer w0.254: v1(6.39,61.48) 5.88,61.99 5.88,64.24
$1N6225: length 2.8
  Bottom Layer w0.254: R1.2 19.01,38.99 17.89,38.99 16.73,40.16
$1N6251: length 3.8
  Bottom Layer w0.254: R2.2 18.11,37.41 16.73,36.02 16.73,35.08
$1N10226: length 1.7
  Bottom Layer w0.254: R23.2 19.04,42.9 3V3.2
$1N10294: length 1.7
  Bottom Layer w0.254: 5V.2 19.04,47.98 R24.2
$1N10362: length 1.7
  Bottom Layer w0.254: 12V.2 19.04,58.19 R25.2
$1N25782: length 2.3
  Bottom Layer w0.254: R5.2 18.99,53.2 MCU1.1

## Copper pours and planes (outline as drawn; the poured copper is in the pictures)
+3V3 on Top Layer: 13.92,48.73 15.3,48.73 15.3,46.39 13.92,46.39
+3V3 on Bottom Layer: 13.95,50.15 15.33,50.15 15.33,47.81 13.95,47.81
+3V3 on Bottom Layer: 8.16,32.06 8.82,32.06 8.82,30.12 8.16,30.12
+5V on Top Layer: 7.04,46.18 5.05,48.17 4.49,48.17 4.49,50.57 5.21,51.29 11.47,51.29 11.47,50.42 10.35,50.42 8.62,48.68 8.62,43.18 7.04,43.18
+12V on Top Layer: 9.9,52.95 9.9,55.82 8.33,57.41 0.44,57.41 0.44,59.65 10.81,59.65 10.81,58.87 11.47,58.21 11.47,52.95
+12V on Bottom Layer: 0.26,68.9 3.72,68.9 3.72,4.01 0.26,4.01
+12V on Bottom Layer: 3.25,15.98 4.52,15.98 4.52,11.73 3.25,11.73
+12V on Bottom Layer: 3.25,23.48 4.52,23.48 4.52,19.23 3.25,19.23
+12V on Bottom Layer: 3.25,8.48 4.52,8.48 4.52,4.24 3.25,4.24
+12V_BEFORE on Top Layer: 0.41,66.75 0.41,75.1 3.82,75.1 3.82,67.61 12.65,67.61 12.65,66.75
+12V_BEFORE on Top Layer: 6.89,69.16 8.31,69.16 8.31,66.79 6.89,66.79
+12V_BEFORE on Top Layer: 11.69,69.16 12.65,69.16 12.65,66.79 11.69,66.79
GND on Top Layer: 10.11,28.66 20,28.66 20,23.67 10.11,23.67
GND on Top Layer: 3.75,75.11 19.72,75.11 19.72,67.34 3.75,67.34
GND on Top Layer: 4.45,67.56 19.81,67.56 19.81,57.1 4.45,57.1
GND on Top Layer: 3.88,47.5 6.4,47.5 6.4,41.58 3.88,41.58
GND on Top Layer: 16.76,30.61 20.88,30.61 20.88,4.04 16.76,4.04
GND on Top Layer: -10.57,57.3 19.82,57.3 19.82,30.59 -10.57,30.59
GND on Bottom Layer: 3.95,75.75 20.88,75.75 20.88,4.04 3.95,4.04
GND on Bottom Layer: 15.81,27.31 19.56,27.31 19.56,3.99 15.81,3.99
GND on Inner1: -3.01,75.75 20.88,75.75 20.88,4.04 -3.01,4.04
L_VS1 on Top Layer: 8.87,23.49 11.31,23.49 11.31,19.69 8.87,19.69
L_VS1 on Top Layer: 7.11,28.48 7.93,28.48 7.93,26.7 7.11,26.7
L_VS1 on Bottom Layer: 8.87,23.49 11.34,23.49 11.34,19.19 8.87,19.19
L_VS2 on Top Layer: 8.87,15.99 11.31,15.99 11.31,12.2 8.87,12.2
L_VS2 on Top Layer: 8.11,28.48 8.93,28.48 8.93,26.7 8.11,26.7
L_VS2 on Bottom Layer: 8.87,15.99 11.34,15.99 11.34,11.7 8.87,11.7
L_VS3 on Top Layer: 8.87,8.5 11.31,8.5 11.31,4.7 8.87,4.7
L_VS3 on Top Layer: 9.11,28.48 9.93,28.48 9.93,26.7 9.11,26.7
L_VS3 on Bottom Layer: 8.87,8.5 11.34,8.5 11.34,4.2 8.87,4.2
$1N4187 on Top Layer: 4.49,56.84 8.11,56.84 8.11,54.36 9.97,52.51 11.47,52.51 11.47,51.69 5.2,51.69 4.49,52.41
$1N4187 on Bottom Layer: 5.35,57 7.96,57 7.96,55.16 5.35,55.16

Small or netless copper shapes (teardrops, artwork), in the pictures only: 154 on Top Layer, 227 on Bottom Layer, 47 on Inner2

## Text on the board
Bottom Silkscreen Layer: AH | BL | BH | CL | CH | AL
Top Solder Mask Layer: FOC Screwdriver | AT32M416
Top Silkscreen Layer: GND VCC | 04/12/2025 / Ver 0.21
